# Altium schematic sheet stm32h743.SchDoc
size A3
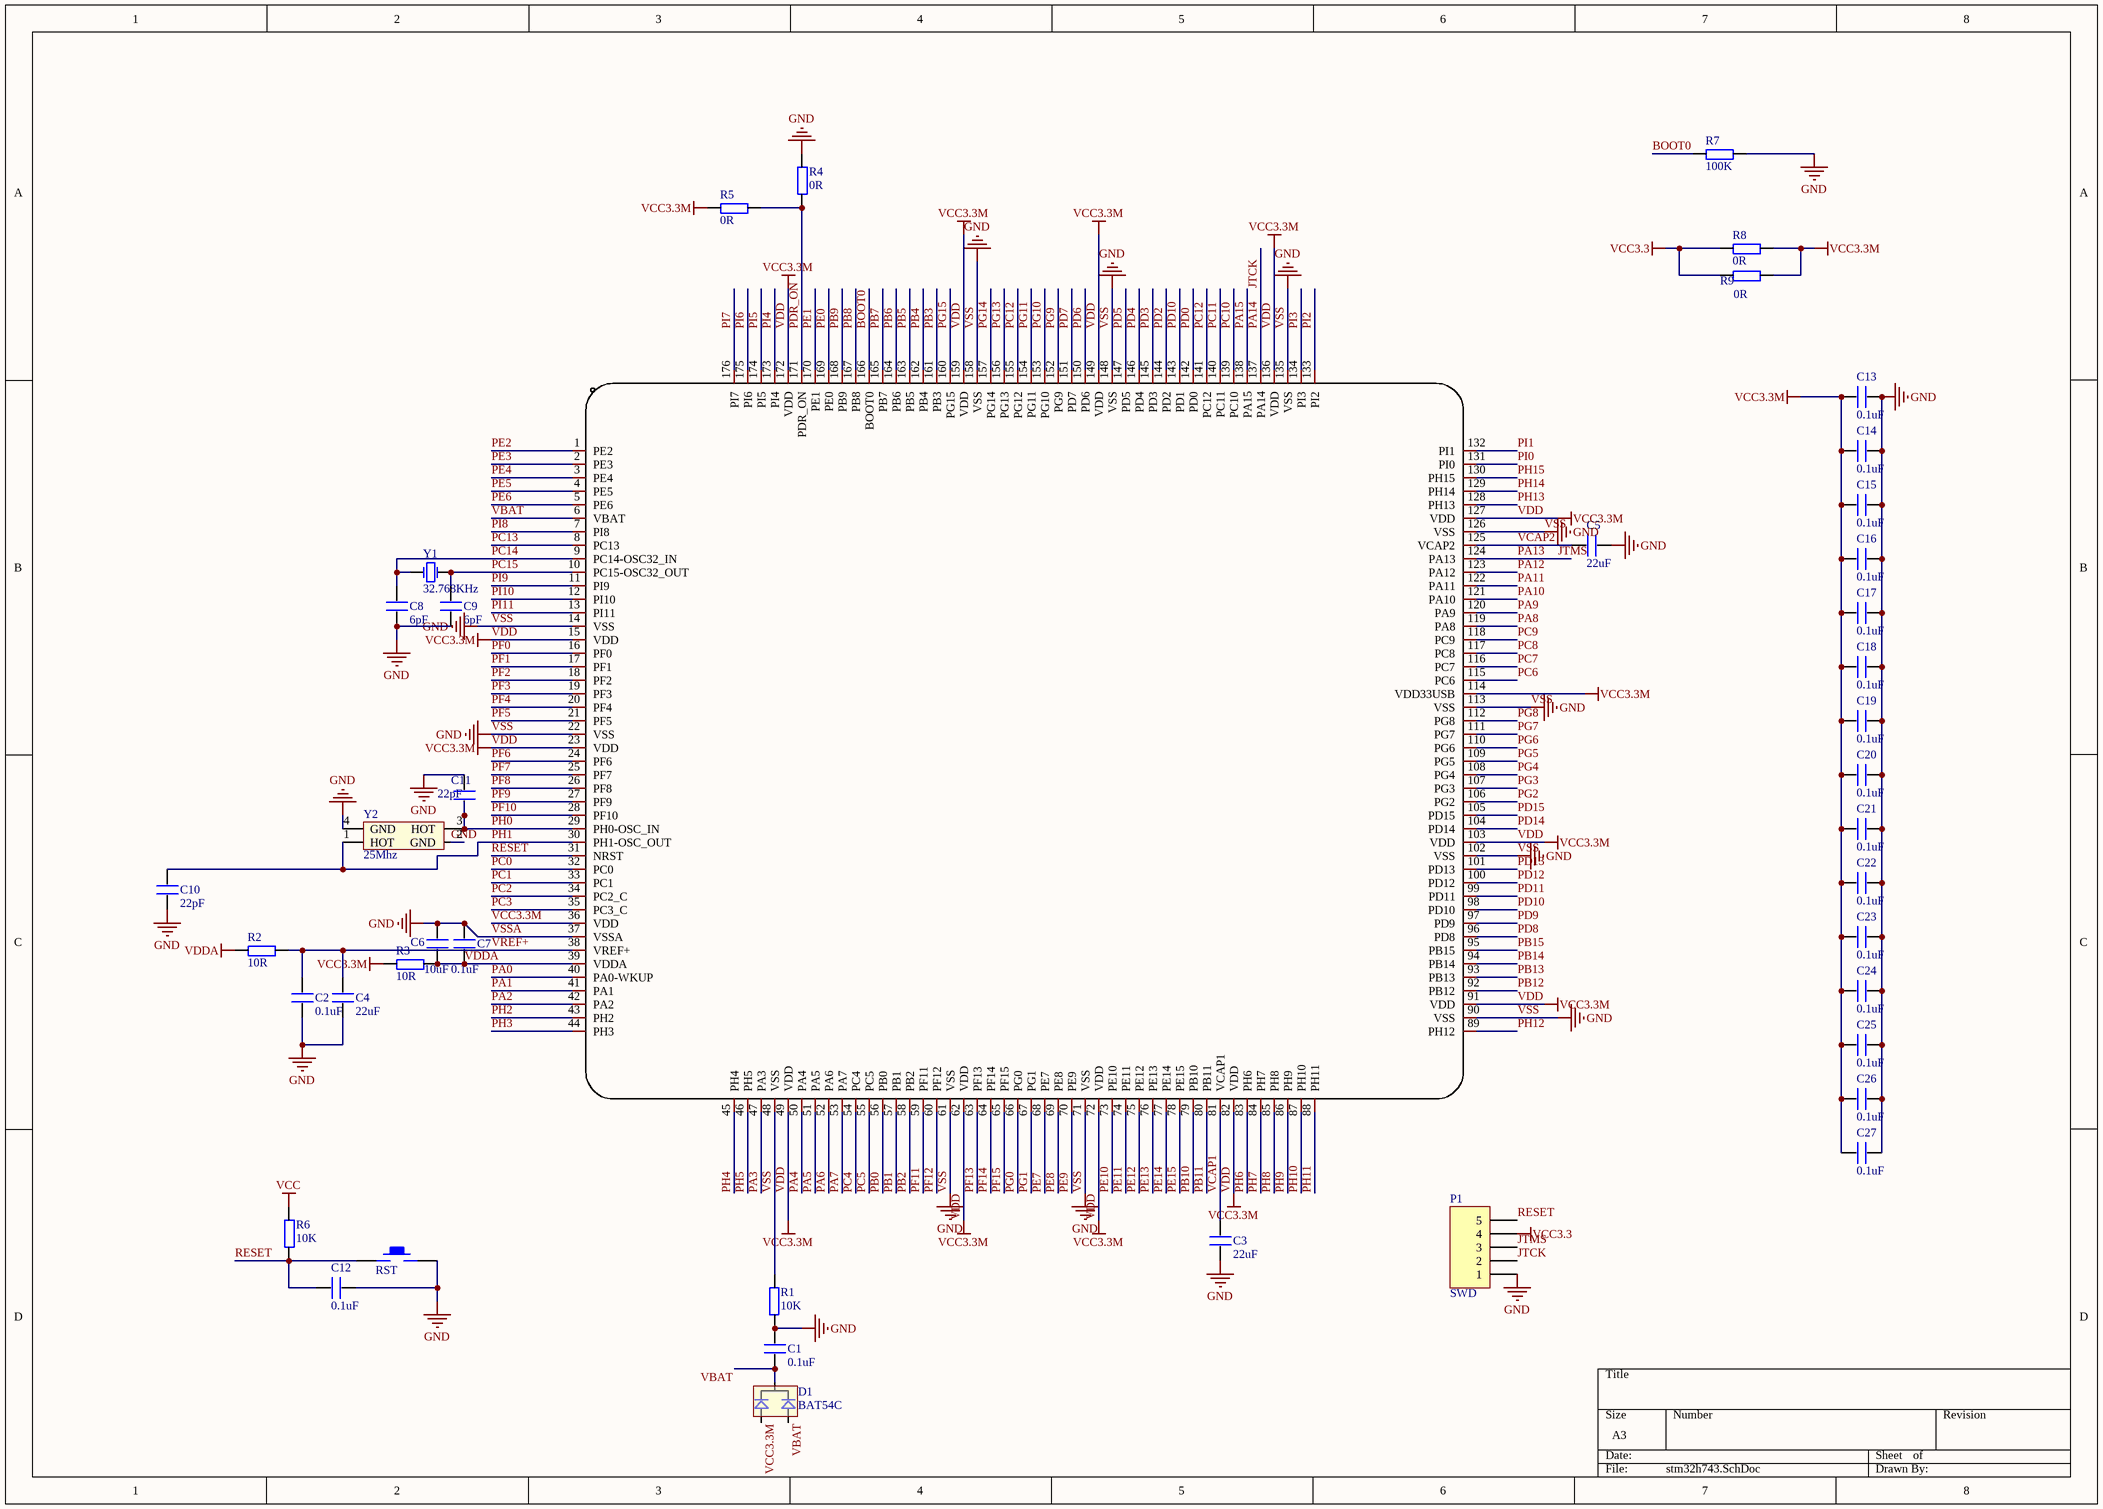
[diagram p0: stm32h743.SchDoc]

## Parts
C1  0.1uF  [0402]
C2  0.1uF  [0402]
C3  22uF  [0402]
C4  22uF  [0402]
C5  22uF  [0402]
C6  10uF  [0402]
C7  0.1uF  [0402]
C8  6pF  [0402]
C9  6pF  [0402]
C10  22pF  [0402]
C11  22pF  [0402]
C12  0.1uF  [0402]
C13  0.1uF  [0402]
C14  0.1uF  [0402]
C15  0.1uF  [0402]
C16  0.1uF  [0402]
C17  0.1uF  [0402]
C18  0.1uF  [0402]
C19  0.1uF  [0402]
C20  0.1uF  [0402]
C21  0.1uF  [0402]
C22  0.1uF  [0402]
C23  0.1uF  [0402]
C24  0.1uF  [0402]
C25  0.1uF  [0402]
C26  0.1uF  [0402]
C27  0.1uF  [0402]
D1  BAT54C  [SOT-23]
P1  SWD  [HDR1X5]
R1  10K  [0402]
R2  10R  [0402]
R3  10R  [0402]
R4  0R  [0402]
R5  0R  [0402]
R6  10K  [0402]
R7  100K  [0402]
R8  0R  [0402]
R9  0R  [0402]
RST  KEY_M  [KEY_SOP324225]  (value not drawn)
U1  STM32H743IIT6  [LQFP176]  (value not drawn)
Y1  32.768KHz  [XTAL3215]
Y2  25Mhz  [XTAL3225]

## Nets
GND: C1.1 C2.1 C3.1 C4.1 C5.2 C6.2 C7.2 C8.1 C9.1 C10.1 C11.1 C12.2 C13.2 C14.2 C15.2 C16.2 C17.2 C18.2 C19.2 C20.2 C21.2 C22.2 C23.2 C24.2 C25.2 C26.2 C27.2 P1.1 R1.1 R1.2 R4.2 R7.2 RST.2 U1.14(VSS) U1.22(VSS) U1.37(VSSA) U1.48(VSS) U1.61(VSS) U1.71(VSS) U1.90(VSS) U1.102(VSS) U1.113(VSS) U1.126(VSS) U1.135(VSS) U1.148(VSS) U1.158(VSS) Y2.2(GND) Y2.4(GND)  [also labelled VSS, VSSA]
VCC: R6.2
VCC3.3: P1.4 R8.1 R9.1
VCC3.3M: C13.1 C14.1 C15.1 C16.1 C17.1 C18.1 C19.1 C20.1 C21.1 C22.1 C23.1 C24.1 C25.1 C26.1 C27.1 D1.1 R3.1 R5.1 R8.2 R9.2 U1.15(VDD) U1.23(VDD) U1.36(VDD) U1.49(VDD) U1.62(VDD) U1.72(VDD) U1.82(VDD) U1.91(VDD) U1.103(VDD) U1.114(VDD33USB) U1.127(VDD) U1.136(VDD) U1.149(VDD) U1.159(VDD) U1.172(VDD)  [also labelled VDD]
VDDA: C6.1 C7.1 R2.1 R3.2 U1.39(VDDA)
BOOT0: R7.1 U1.166(BOOT0)
JTCK: P1.2 U1.137(PA14)  [also labelled PA14]
JTMS: P1.3 U1.124(PA13)  [also labelled PA13]
PA0: U1.40(PA0-WKUP)
PA1: U1.41(PA1)
PA2: U1.42(PA2)
PA3: U1.47(PA3)
PA4: U1.50(PA4)
PA5: U1.51(PA5)
PA6: U1.52(PA6)
PA7: U1.53(PA7)
PA8: U1.119(PA8)
PA9: U1.120(PA9)
PA10: U1.121(PA10)
PA11: U1.122(PA11)
PA12: U1.123(PA12)
PA15: U1.138(PA15)
PB0: U1.56(PB0)
PB1: U1.57(PB1)
PB2: U1.58(PB2)
PB3: U1.161(PB3)
PB4: U1.162(PB4)
PB5: U1.163(PB5)
PB6: U1.164(PB6)
PB7: U1.165(PB7)
PB8: U1.167(PB8)
PB9: U1.168(PB9)
PB10: U1.79(PB10)
PB11: U1.80(PB11)
PB12: U1.92(PB12)
PB13: U1.93(PB13)
PB14: U1.94(PB14)
PB15: U1.95(PB15)
PC0: U1.32(PC0)
PC1: U1.33(PC1)
PC2: U1.34(PC2_C)
PC3: U1.35(PC3_C)
PC4: U1.54(PC4)
PC5: U1.55(PC5)
PC6: U1.115(PC6)
PC7: U1.116(PC7)
PC8: U1.117(PC8)
PC9: U1.118(PC9)
PC10: U1.139(PC10)
PC11: U1.140(PC11)
PC12: U1.141(PC12) U1.155(PG12)
PC13: U1.8(PC13)
PC14: C8.2 U1.9(PC14-OSC32_IN) Y1.1(OSC1)
PC15: C9.2 U1.10(PC15-OSC32_OUT) Y1.2(OSC2)
PD0: U1.142(PD0)
PD2: U1.144(PD2)
PD3: U1.145(PD3)
PD4: U1.146(PD4)
PD5: U1.147(PD5)
PD6: U1.150(PD6)
PD7: U1.151(PD7)
PD8: U1.96(PD8)
PD9: U1.97(PD9)
PD10: U1.98(PD10) U1.143(PD1)
PD11: U1.99(PD11)
PD12: U1.100(PD12)
PD13: U1.101(PD13)
PD14: U1.104(PD14)
PD15: U1.105(PD15)
PDR_ON: R4.1 R5.2 U1.171(PDR_ON)
PE0: U1.169(PE0)
PE1: U1.170(PE1)
PE2: U1.1(PE2)
PE3: U1.2(PE3)
PE4: U1.3(PE4)
PE5: U1.4(PE5)
PE6: U1.5(PE6)
PE7: U1.68(PE7)
PE8: U1.69(PE8)
PE9: U1.70(PE9)
PE10: U1.73(PE10)
PE11: U1.74(PE11)
PE12: U1.75(PE12)
PE13: U1.76(PE13)
PE14: U1.77(PE14)
PE15: U1.78(PE15)
PF0: U1.16(PF0)
PF1: U1.17(PF1)
PF2: U1.18(PF2)
PF3: U1.19(PF3)
PF4: U1.20(PF4)
PF5: U1.21(PF5)
PF6: U1.24(PF6)
PF7: U1.25(PF7)
PF8: U1.26(PF8)
PF9: U1.27(PF9)
PF10: U1.28(PF10)
PF11: U1.59(PF11)
PF12: U1.60(PF12)
PF13: U1.63(PF13)
PF14: U1.64(PF14)
PF15: U1.65(PF15)
PG0: U1.66(PG0)
PG1: U1.67(PG1)
PG2: U1.106(PG2)
PG3: U1.107(PG3)
PG4: U1.108(PG4)
PG5: U1.109(PG5)
PG6: U1.110(PG6)
PG7: U1.111(PG7)
PG8: U1.112(PG8)
PG9: U1.152(PG9)
PG10: U1.153(PG10)
PG11: U1.154(PG11)
PG13: U1.156(PG13)
PG14: U1.157(PG14)
PG15: U1.160(PG15)
PH0: C11.2 U1.29(PH0-OSC_IN) Y2.3(HOT)
PH1: C10.2 U1.30(PH1-OSC_OUT) Y2.1(HOT)
PH2: U1.43(PH2)
PH3: U1.44(PH3)
PH4: U1.45(PH4)
PH5: U1.46(PH5)
PH6: U1.83(PH6)
PH7: U1.84(PH7)
PH8: U1.85(PH8)
PH9: U1.86(PH9)
PH10: U1.87(PH10)
PH11: U1.88(PH11)
PH12: U1.89(PH12)
PH13: U1.128(PH13)
PH14: U1.129(PH14)
PH15: U1.130(PH15)
PI0: U1.131(PI0)
PI1: U1.132(PI1)
PI2: U1.133(PI2)
PI3: U1.134(PI3)
PI4: U1.173(PI4)
PI5: U1.174(PI5)
PI6: U1.175(PI6)
PI7: U1.176(PI7)
PI8: U1.7(PI8)
PI9: U1.11(PI9)
PI10: U1.12(PI10)
PI11: U1.13(PI11)
RESET: C12.1 P1.5 R6.1 RST.1 U1.31(NRST)
VBAT: C1.2 D1.2 D1.3 U1.6(VBAT)
VCAP1: C3.2 U1.81(VCAP1)
VCAP2: C5.1 U1.125(VCAP2)
VREF+: C2.2 C4.2 R2.2 U1.38(VREF+)

## Library data of the parts
C1-C7 C10-C27 = C
C8 C9 = C_7
D1 = BAT54C: 双肖特基二极管
P1 = Header 5: Header, 5-Pin; LatestRevisionDate: 17-Jul-2002; LatestRevisionNote: Re-released for DXP Platform.; Publisher: Altium Limited
R1-R9 = R
U1 = STM32H743IIT6: Manufacturer: ST(意法半导体); Add into BOM: yes; CPU Core: ARM-M系列; Program Storage Size: 2MB; RAM Size: 1MB; GPIO Ports Number: 140; Operating Voltage Range: 1.62V~3.6V; CPU Maximum Speed: 480MHz; Program Memory Type: FLASH; ADC (Bit): 16bit; DAC (Bit): 12bit; Universal Serial Bus: 有; Peripheral/Function: DMA；LCD/LED驱动；PWM; Symbol: STM32H743IIT6; Device: STM32H743IIT6; LCSC Part Name: STM32H743IIT6; Supplier Part: C89597; Manufacturer Part: STM32H743IIT6; Supplier Footprint: LQFP-176(24x24); JLCPCB Part Class: Extended Part; Datasheet: https://atta.szlcsc.com/upload/public/pdf/source/20180326/C129442_D4CD7A13251C79DE4F637D238512E0C6.pdf; Supplier: LCSC; Convert to PCB: yes; Operating Temperature Range: -40℃~+85℃; PWM (Bit): -; Internal Comparator: -; communication protocol: -; Watchdog: 有; Real-Time Clock: -; Infrared Data Association: 有; Low-Voltage Detect: 有; CCP Capture/Compare: -; LCD Module: 有; Secure Digital Input and Output: 有; Direct Memory Access: 有; Internal Oscillator: 有
Y1 = XTAL: 普通晶振; Published: 8-Jun-2000; LatestRevisionDate: 17-Jul-2002; LatestRevisionNote: Re-released for DXP Platform.; Publisher: Altium Limited
Y2 = XTAL_3225: 3225贴片无源晶振